# EAGLE design main (EAGLE 9.6.2)
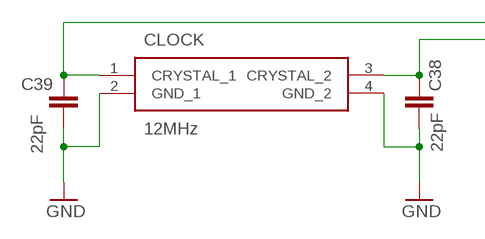
[diagram p0: schematic, sheet 1, part 1 of 3]
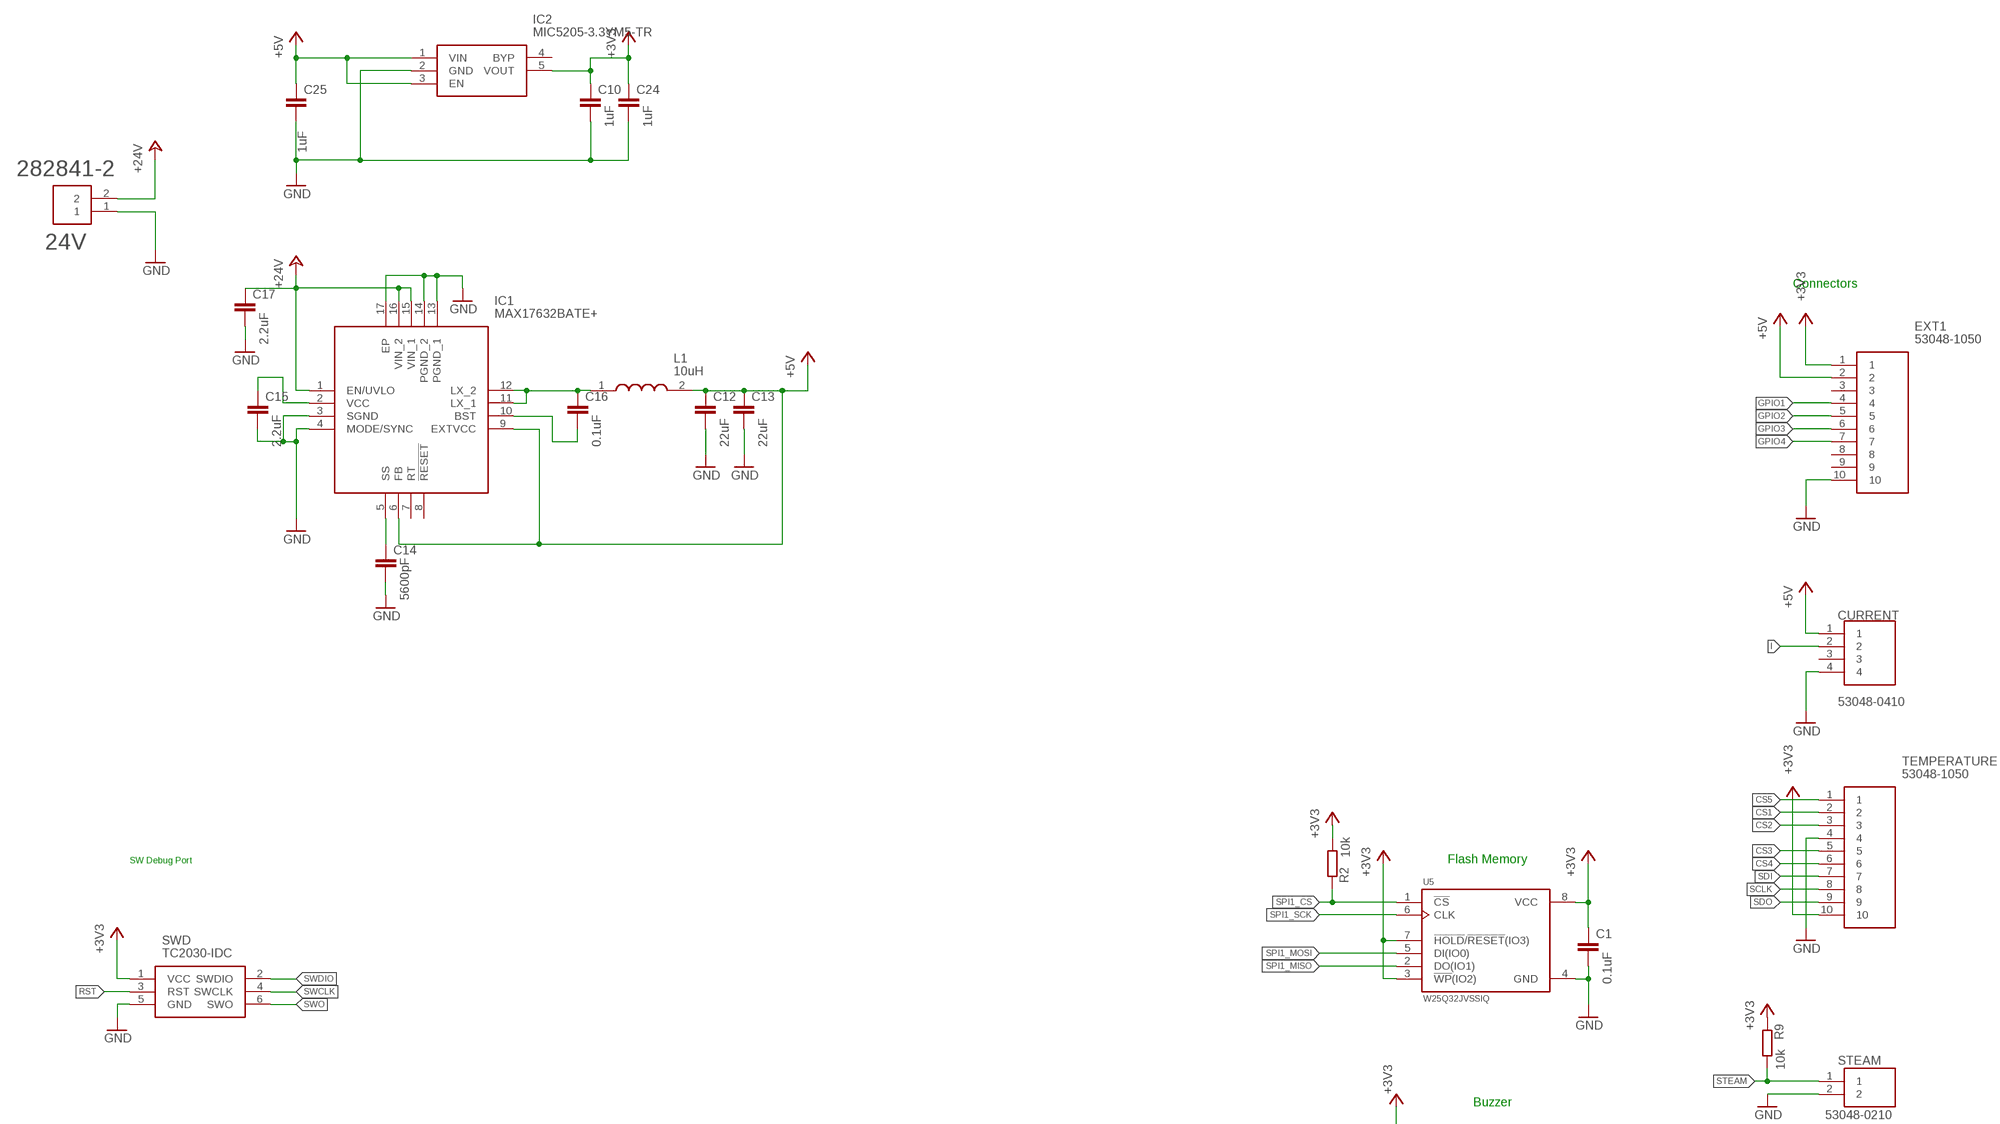
[diagram p1: schematic, sheet 1, part 2 of 3]
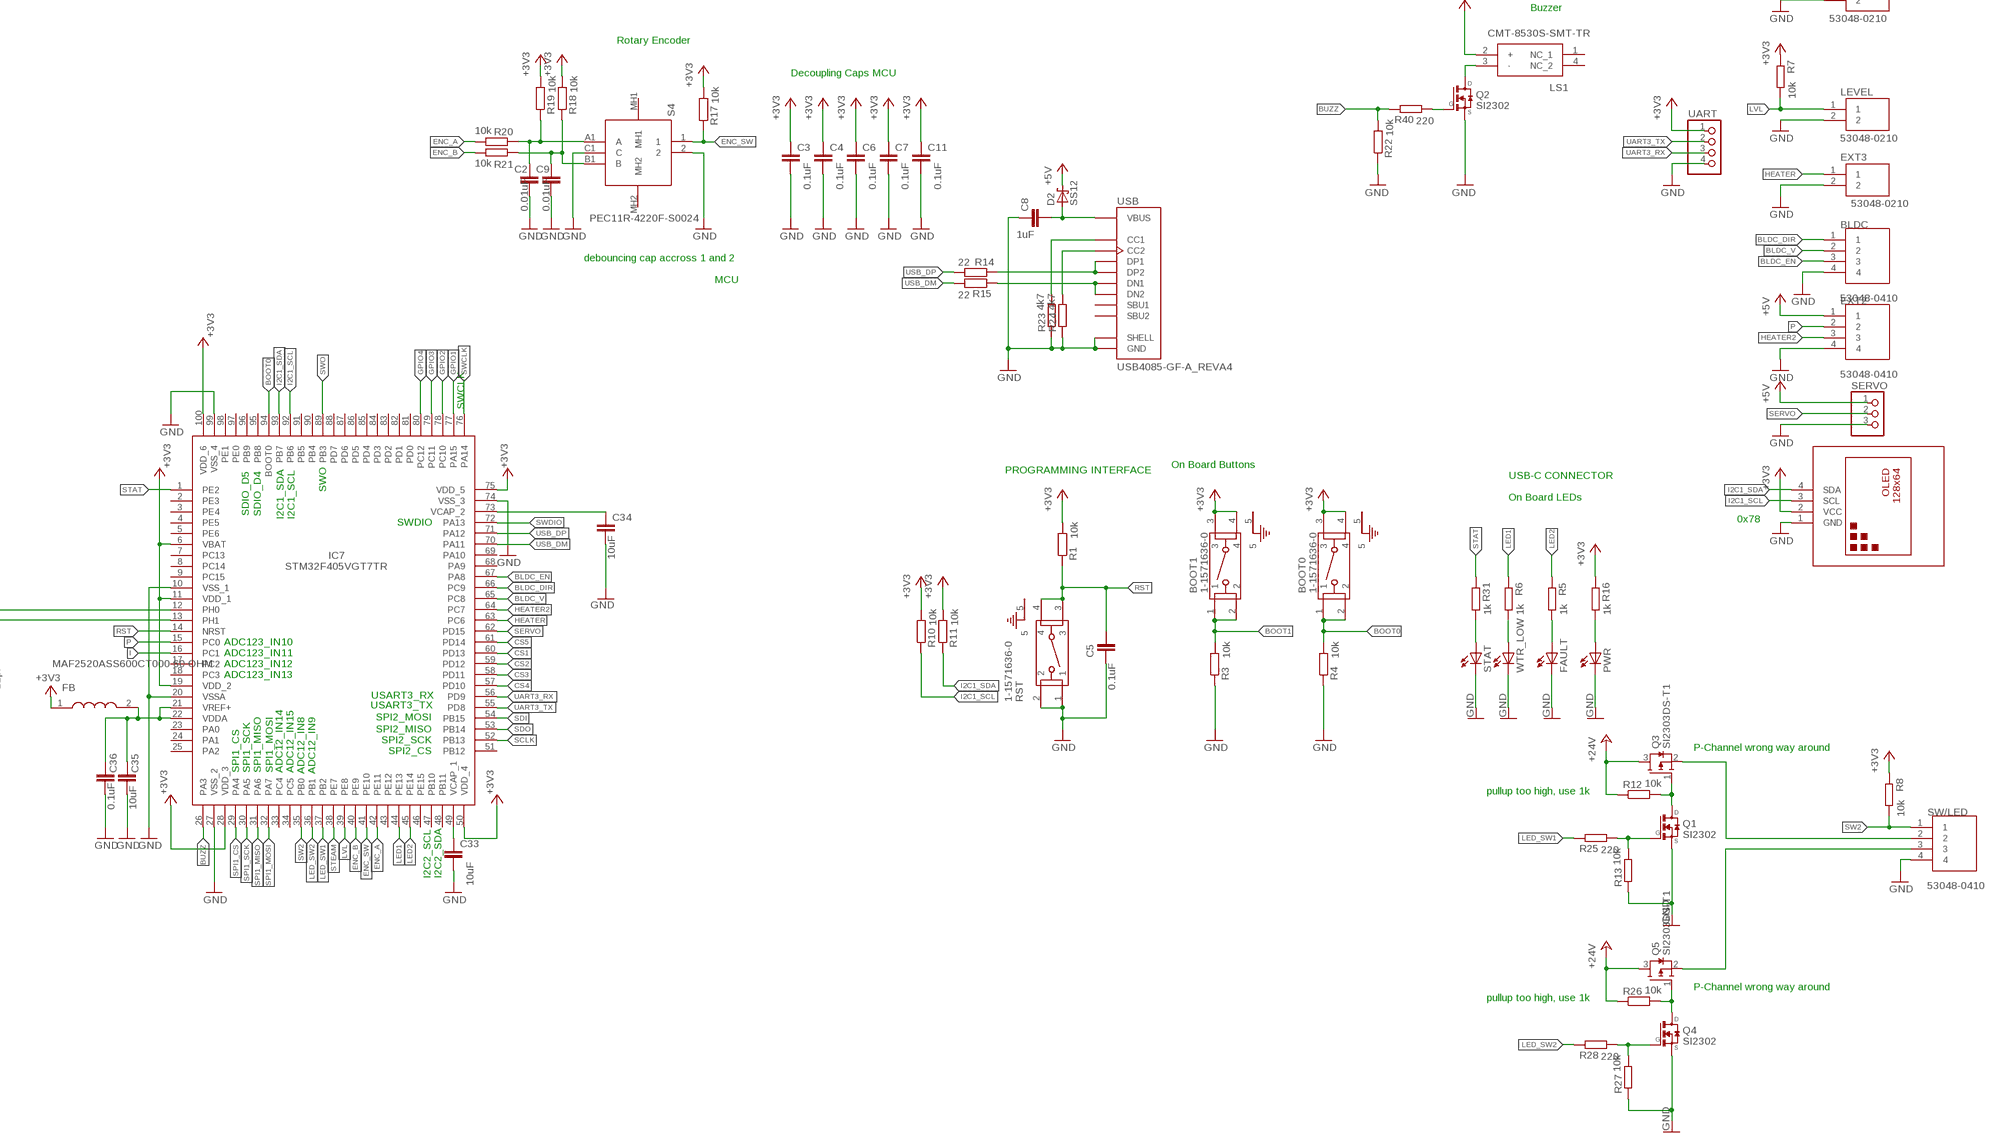
[diagram p2: schematic, sheet 1, part 3 of 3]

## Parts
24V  282841-2  [TE_282841-2]
BLDC  53048-0410  [530480410]
BOOT0  1-1571636-0  [SW5_1571636]
BOOT1  1-1571636-0  [SW5_1571636]
C1  0.1uF  C-EUC0603K  [C0603K]
C2  0.01uF  C-EUC0603K  [C0603K]
C3  0.1uF  C-EUC0603K  [C0603K]
C4  0.1uF  C-EUC0603K  [C0603K]
C5  0.1uF  C-EUC0603K  [C0603K]
C6  0.1uF  C-EUC0603K  [C0603K]
C7  0.1uF  C-EUC0603K  [C0603K]
C8  1uF  C-EUC0603K  [C0603K]
C9  0.01uF  C-EUC0603K  [C0603K]
C10  1uF  C-EUC0603K  [C0603K]
C11  0.1uF  C-EUC0603K  [C0603K]
C12  22uF  C-EUC0603K  [C0603K]
C13  22uF  C-EUC0603K  [C0603K]
C14  5600pF  C-EUC0603K  [C0603K]
C15  2.2uF  C-EUC0603K  [C0603K]
C16  0.1uF  C-EUC0603K  [C0603K]
C17  2.2uF  C-EUC0603K  [C0603K]
C24  1uF  C-EUC0603K  [C0603K]
C25  1uF  C-EUC0603K  [C0603K]
C33  10uF  C-EUC0603K  [C0603K]
C34  10uF  C-EUC0603K  [C0603K]
C35  10uF  C-EUC0603K  [C0603K]
C36  0.1uF  C-EUC0603K  [C0603K]
C38  22pF  C-EUC0603K  [C0603K]
C39  22pF  C-EUC0603K  [C0603K]
CLOCK  12MHz  ABM8AIG-8.000MHZ-1Z-T  [ABM8AIG8000MHZ1ZT]
CURRENT  53048-0410  [530480410]
D2  SS12  [DO214AC]
DISPLAY  DISPLAY-OLED-128X64-I2C  [DISPLAY-OLED-128X64-I2C]
EXT1  53048-1050  [SHDRRA10W25P0X125_1X10_1425X55]
EXT2  53048-0410  [530480410]
EXT3  53048-0210  [SHDRRA2W35P0X125_1X2_425X550X3]
FAULT  LEDCHIPLED_0805  [CHIPLED_0805]
FB  MAF2520ASS600CT000 60 OHM  DFE252012P-1R0M=P2  [INDC2520X120N]
IC1  MAX17632BATE+  [QFN50P300X300X80-17N]
IC2  MIC5205-3.3YM5-TR  [SOT95P280X145-5N]
IC7  STM32F405VGT7TR  [QFP50P1600X1600X160-100N]
L1  10uH  CBC3225T100KR  [INDC3225X270N]
LEVEL  53048-0210  [SHDRRA2W35P0X125_1X2_425X550X3]
LS1  CMT-8530S-SMT-TR  [CMT8530SSMTTR]
PWR  LEDCHIPLED_0805  [CHIPLED_0805]
Q1  SI2302  [SOT23]
Q2  SI2302  [SOT23]
Q3  SI2303DS-T1  [SOT90P248X115-3N]
Q4  SI2302  [SOT23]
Q5  SI2303DS-T1  [SOT90P248X115-3N]
R1  10k  R-EU_R0603  [R0603]
R2  10k  R-EU_R0603  [R0603]
R3  10k  R-EU_R0603  [R0603]
R4  10k  R-EU_R0603  [R0603]
R5  1k  R-EU_R0603  [R0603]
R6  1k  R-EU_R0603  [R0603]
R7  10k  R-EU_R0603  [R0603]
R8  10k  R-EU_R0603  [R0603]
R9  10k  R-EU_R0603  [R0603]
R10  10k  R-EU_R0603  [R0603]
R11  10k  R-EU_R0603  [R0603]
R12  10k  R-EU_R0603  [R0603]
R13  10k  R-EU_R0603  [R0603]
R14  22  R-EU_R0603  [R0603]
R15  22  R-EU_R0603  [R0603]
R16  1k  R-EU_R0603  [R0603]
R17  10k  R-EU_R0603  [R0603]
R18  10k  R-EU_R0603  [R0603]
R19  10k  R-EU_R0603  [R0603]
R20  10k  R-EU_R0603  [R0603]
R21  10k  R-EU_R0603  [R0603]
R22  10k  R-EU_R0603  [R0603]
R23  4k7  R-EU_R0603  [R0603]
R24  4k7  R-EU_R0603  [R0603]
R25  220  R-EU_R0603  [R0603]
R26  10k  R-EU_R0603  [R0603]
R27  10k  R-EU_R0603  [R0603]
R28  220  R-EU_R0603  [R0603]
R31  1k  R-EU_R0603  [R0603]
R40  220  R-EU_R0603  [R0603]
RST  1-1571636-0  [SW5_1571636]
S4  PEC11R-4220F-S0024  [PEC11R4220FS0024]
SERVO  PINHD-1X3/90  [1X03/90]
STAT  LEDCHIPLED_0805  [CHIPLED_0805]
STEAM  53048-0210  [SHDRRA2W35P0X125_1X2_425X550X3]
SW/LED  53048-0410  [530480410]
SWD  TC2030-IDC  [TC2030IDC]
TEMPERATURE  53048-1050  [SHDRRA10W25P0X125_1X10_1425X55]
U5  W25Q32JVSSIQ  [SOIC127P790X216-8N]
UART  PINHD-1X4  [1X04]
USB  USB4085-GF-A_REVA4  [GCT_USB4085-GF-A_REVA4]
WTR_LOW  LEDCHIPLED_0805  [CHIPLED_0805]

## Nets
+3V3: BOOT0.3 BOOT0.4 BOOT1.3 BOOT1.4 C1.1 C3.1 C4.1 C6.1 C7.1 C10.1 C11.1 C24.1 DISPLAY.2(VCC) EXT1.1 FB.1 IC2.5(VOUT) IC7.6(VBAT) IC7.11(VDD_1) IC7.19(VDD_2) IC7.28(VDD_3) IC7.50(VDD_4) IC7.75(VDD_5) IC7.100(VDD_6) LS1.2(+) R1.2 R2.2 R7.1 R8.1 R9.1 R10.2 R11.2 R16.1 R17.2 R18.2 R19.2 SWD.1(VCC) TEMPERATURE.10 U5.3(!WP!(IO2)) U5.7(!HOLD!/!RESET!(IO3)) U5.8(VCC) UART.1
+5V: C12.1 C13.1 C25.1 CURRENT.1 D2.C EXT1.2 EXT2.1 IC1.6(FB) IC1.9(EXTVCC) IC2.1(VIN) IC2.3(EN) L1.2 SERVO.1
+24V: 24V.2 C17.1 IC1.1(EN/UVLO) IC1.15(VIN_1) IC1.16(VIN_2) Q3.3(D) Q5.3(D) R12.1 R26.1
BLDC_DIR: BLDC.1 IC7.66(PC9)
BLDC_EN: BLDC.3 IC7.67(PA8)
BLDC_V: BLDC.2 IC7.65(PC8)
BOOT0: BOOT0.1 BOOT0.2 IC7.94(BOOT0) R4.2
BOOT1: BOOT1.1 BOOT1.2 R3.2
BUZZ: IC7.26(PA3) R22.2 R40.1
CS1: IC7.60(PD13) TEMPERATURE.2
CS2: IC7.59(PD12) TEMPERATURE.3
CS3: IC7.58(PD11) TEMPERATURE.5
CS4: IC7.57(PD10) TEMPERATURE.6
CS5: IC7.61(PD14) TEMPERATURE.1
ENC_A: IC7.42(PE11) R20.2
ENC_B: IC7.40(PE9) R21.2
ENC_SW: IC7.41(PE10) R17.1 S4.1
GND: 24V.1 BLDC.4 C1.2 C2.2 C3.2 C4.2 C5.2 C6.2 C7.2 C8.1 C9.2 C10.2 C11.2 C12.2 C13.2 C14.2 C15.2 C17.2 C24.2 C25.2 C33.2 C34.2 C35.2 C36.2 C38.2 C39.2 CLOCK.2(GND_1) CLOCK.4(GND_2) CURRENT.4 DISPLAY.1(GND) EXT1.10 EXT2.4 EXT3.2 FAULT.C IC1.3(SGND) IC1.4(MODE/SYNC) IC1.13(PGND_1) IC1.14(PGND_2) IC1.17(EP) IC2.2(GND) IC7.10(VSS_1) IC7.20(VSSA) IC7.27(VSS_2) IC7.74(VSS_3) IC7.99(VSS_4) LEVEL.2 PWR.C Q1.2(S) Q2.2(S) Q4.2(S) R3.1 R4.1 R13.1 R22.1 R23.1 R24.1 R27.1 RST.1 RST.2 S4.2 S4.C1(C) SERVO.3 STAT.C STEAM.2 SW/LED.4 SWD.5(GND) TEMPERATURE.4 U5.4(GND) UART.4 USB.A1(GND) USB.A12(GND) USB.B1(GND) USB.B12(GND) USB.P1(SHELL) USB.P2(SHELL) USB.P3(SHELL) USB.P4(SHELL) WTR_LOW.C
GPIO1: EXT1.4 IC7.77(PA15)
GPIO2: EXT1.5 IC7.78(PC10)
GPIO3: EXT1.6 IC7.79(PC11)
GPIO4: EXT1.7 IC7.80(PC12)
HEATER: EXT3.1 IC7.63(PC6)
HEATER2: EXT2.3 IC7.64(PC7)
I: CURRENT.2 IC7.16(PC1)
I2C1_SCL: DISPLAY.3(SCL) IC7.92(PB6) R10.1
I2C1_SDA: DISPLAY.4(SDA) IC7.93(PB7) R11.1
LED1: IC7.44(PE13) R6.1
LED2: IC7.45(PE14) R5.1
LED_SW1: IC7.37(PB2) R25.1
LED_SW2: IC7.36(PB1) R28.1
LVL: IC7.39(PE8) LEVEL.1 R7.2
N$1: R14.1 USB.A6(DP1) USB.B6(DP2)
N$2: R15.1 USB.A7(DN1) USB.B7(DN2)
N$3: R24.2 USB.B5(CC2)
N$4: R23.2 USB.A5(CC1)
N$5: LS1.3(-) Q2.3(D)
N$6: R6.2 WTR_LOW.A
N$7: PWR.A R16.2
N$9: FAULT.A R5.2
N$10: R31.2 STAT.A
N$12: C9.1 R18.1 R21.1 S4.B1(B)
N$13: C14.1 IC1.5(SS)
N$14: C2.1 R19.1 R20.1 S4.A1(A)
N$15: C16.2 IC1.10(BST)
N$16: C8.2 D2.A USB.A4(VBUS) USB.A9(VBUS) USB.B4(VBUS) USB.B9(VBUS)
N$17: Q1.3(D) Q3.1(G) R12.2
N$19: C15.1 IC1.2(VCC)
N$21: C16.1 IC1.11(LX_1) IC1.12(LX_2) L1.1
N$22: Q1.1(G) R13.2 R25.2
N$23: C34.1 IC7.73(VCAP_2)
N$24: Q4.3(D) Q5.1(G) R26.2
N$26: Q4.1(G) R27.2 R28.2
N$27: C35.1 C36.1 FB.2 IC7.21(VREF+) IC7.22(VDDA)
N$28: Q3.2(S) SW/LED.2
N$29: Q5.2(S) SW/LED.3
N$35: Q2.1(G) R40.2
N$38: C33.1 IC7.49(VCAP_1)
N$47: C38.1 CLOCK.3(CRYSTAL_2) IC7.13(PH1)
N$52: C39.1 CLOCK.1(CRYSTAL_1) IC7.12(PH0)
P: EXT2.2 IC7.15(PC0)
RST: C5.1 IC7.14(NRST) R1.1 RST.3 RST.4 SWD.3(RST)
SCLK: IC7.52(PB13) TEMPERATURE.8
SDI: IC7.54(PB15) TEMPERATURE.7
SDO: IC7.53(PB14) TEMPERATURE.9
SERVO: IC7.62(PD15) SERVO.2
SPI1_CS: IC7.29(PA4) R2.1 U5.1(!CS)
SPI1_MISO: IC7.31(PA6) U5.2(DO(IO1))
SPI1_MOSI: IC7.32(PA7) U5.5(DI(IO0))
SPI1_SCK: IC7.30(PA5) U5.6(CLK)
STAT: IC7.1(PE2) R31.1
STEAM: IC7.38(PE7) R9.2 STEAM.1
SW2: IC7.35(PB0) R8.2 SW/LED.1
SWCLK: IC7.76(PA14) SWD.4(SWCLK)
SWDIO: IC7.72(PA13) SWD.2(SWDIO)
SWO: IC7.89(PB3) SWD.6(SWO)
UART3_RX: IC7.56(PD9) UART.3
UART3_TX: IC7.55(PD8) UART.2
USB_DM: IC7.70(PA11) R15.2
USB_DP: IC7.71(PA12) R14.2
Unconnected: BOOT0.5 BOOT1.5 CURRENT.3 EXT1.3 EXT1.8 EXT1.9 IC1.7(RT) IC1.8(!RESET) IC2.4(BYP) IC7.2(PE3) IC7.3(PE4) IC7.4(PE5) IC7.5(PE6) IC7.7(PC13) IC7.8(PC14) IC7.9(PC15) IC7.17(PC2) IC7.18(PC3) IC7.23(PA0) IC7.24(PA1) IC7.25(PA2) IC7.33(PC4) IC7.34(PC5) IC7.43(PE12) IC7.46(PE15) IC7.47(PB10) IC7.48(PB11) IC7.51(PB12) IC7.68(PA9) IC7.69(PA10) IC7.81(PD0) IC7.82(PD1) IC7.83(PD2) IC7.84(PD3) IC7.85(PD4) IC7.86(PD5) IC7.87(PD6) IC7.88(PD7) IC7.90(PB4) IC7.91(PB5) IC7.95(PB8) IC7.96(PB9) IC7.97(PE0) IC7.98(PE1) LS1.1(NC_1) LS1.4(NC_2) RST.5 S4.MH1 S4.MH2 USB.A8(SBU1) USB.B8(SBU2)

## Notes on the sheet
- Connectors
- SW Debug Port | Flash Memory
- Buzzer
- Rotary Encoder
- Decoupling Caps MCU
- debouncing cap accross 1 and 2
- MCU
- SWCLK
- On Board Buttons
- SDIO_D4 | PROGRAMMING INTERFACE
- USB-C CONNECTOR
- SWO
- On Board LEDs
- SDIO_D5
- I2C1_SDA | I2C1_SCL
- 0x78
- SWDIO
- ADC123_IN10
- ADC123_IN11
- ADC123_IN12
- ADC123_IN13
- USART3_RX
- USART3_TX
- SPI2_MOSI
- SPI2_MISO
- SPI2_SCK
- SPI2_CS
- P-Channel wrong way around
- SPI1_CS | SPI1_SCK | SPI1_MISO | SPI1_MOSI | ADC12_IN14 | ADC12_IN15 | ADC12_IN8 | ADC12_IN9
- pullup too high, use 1k
- I2C2_SCL | I2C2_SDA
- P-Channel wrong way around
- pullup too high, use 1k

## Library data of the parts
24V = 282841-2:282841-2: TERM BLOCK 2POS SIDE ENT 5.08MM; COMMENT: 282841-2; DESCRIPTION: Conn Terminal Block 2 POS 5.08mm Solder ST Thru-Hole 17.5A/Contact; DIGI-KEY_PART_NUMBER: A98342-ND; DIGI-KEY_PURCHASE_URL: https://www.digikey.com/product-detail/en/te-connectivity-amp-connectors/282841-2/A98342-ND/1136740?utm_source=snapeda&utm_medium=aggregator&utm_campaign=symbol; EU_ROHS_COMPLIANCE: Compliant with Exemptions; MF: TE Connectivity; MP: 282841-2; PACKAGE: None; TE_PURCHASE_URL: https://www.te.com/usa-en/product-282841-2.html?te_bu=Cor&te_type=disp&te_campaign=seda_glo_cor-seda-global-disp-prtnr-fy19-seda-model-bom-cta_sma-317_1&elqCampaignId=32493
BLDC CURRENT EXT2 SW/LED = 53048-0410:53048-0410: Headers & Wire Housings RIGHT ANGLE HDR 4P Source: Datasheet <https://www.molex.com/pdm_docs/sd/530480410_sd.pdf>; DESCRIPTION: Headers & Wire Housings RIGHT ANGLE HDR 4P; HEIGHT: 3.7mm; MANUFACTURER_NAME: Molex; MANUFACTURER_PART_NUMBER: 53048-0410; MOUSER_PART_NUMBER: 538-53048-0410; MOUSER_PRICE-STOCK: https://www.mouser.co.uk/ProductDetail/Molex/53048-0410?qs=359VwiUTsp2msj5Tobchuw%3D%3D
BOOT0 BOOT1 RST = TACTILE:1-1571636-0; BUILT_BY: EMA_UL_Team; CONFIGURATION__POLE-THROW_: Single Pole - Single Throw; COPYRIGHT: Copyright (C) 2016 Accelerated Designs. All rights reserved; DESCRIPTION: TACT,SMT,GULL WING,260GF,T&R; MANUFACTURER_PART_NUMBER: 1-1571636-0; MAX_SWITCHING_CURRENT: -; MAX_SWITCHING_VOLTAGE_AC_: -; PRODUCT_TYPE: Switch; SWITCH_TYPE: Tactile Switches; TE_PART_NUMBER: 1-1571636-0; VENDOR: TE Connectivity
C1-C17 C24 C25 C33-C36 C38 C39 = rcl:C-EU: CAPACITOR, European symbol; SPICEPREFIX: C
CLOCK = ABM8AIG-8.000MHZ-1Z-T:ABM8AIG-8.000MHZ-1Z-T: Crystals 18pF 8MHz 10ppm AEC-Q200 -40C +125C Source: Datasheet <https://abracon.com/AIGcrystals/ABM8AIG.pdf>; DESCRIPTION: Crystals 18pF 8MHz 10ppm AEC-Q200 -40C +125C; HEIGHT: 0.8mm; MANUFACTURER_NAME: ABRACON; MANUFACTURER_PART_NUMBER: ABM8AIG-8.000MHZ-1Z-T; MOUSER_PART_NUMBER: 815-M8AIG-8-1ZT; MOUSER_PRICE-STOCK: https://www.mouser.com/Search/Refine.aspx?Keyword=815-M8AIG-8-1ZT
D2 = SS12:SS12: http://octopart.com/ss12-tp-mcc-9293796; AVAILABILITY: Unavailable; DESCRIPTION: SS12 Series 500 mV 1 A 20 V Max Reverse Voltage Schottky Rectifier - DO-214AC; MF: Klein Tools,; MP: SS12; PACKAGE: DO-214AC-214 ON Semiconductor; PRICE: None
DISPLAY = diy-modules:DISPLAY-OLED-128X64-I2C: 128x64 Dot Matrix OLED Module based on SSD1306 chip Variant with I2C interface More details available here: http://www.instructables.com/id/Monochrome-096-i2c-OLED-display-with-arduino-SSD13/ SSD1306 datasheet: https://cdn-shop.adafruit.com/datasheets/SSD1306.pdf Click here to find device on ebay.com <http://www.ebay.com/sch/oled+display+128x64+iic> Note: There are two variants: I2C and SPI. Search for the proper version.
EXT1 TEMPERATURE = 53048-1050:53048-1050: 1.25mm Pitch, PicoBlade PCB Header, Single Row, Right-Angle, Through Hole, Gold (Au) Plating, Friction Lock, 4 Circuits, Tape and Reel, 2.30mm PC Tail Length Source: Datasheet <https://www.mouser.com/datasheet/2/276/0530481050_PCB_HEADERS-1532231.pdf>; DESCRIPTION: 1.25mm Pitch, PicoBlade PCB Header, Single Row, Right-Angle, Through Hole, Gold (Au) Plating, Friction Lock, 4 Circuits, Tape and Reel, 2.30mm PC Tail Length; HEIGHT: 3.5mm; MANUFACTURER_NAME: Molex; MANUFACTURER_PART_NUMBER: 53048-1050; MOUSER_PART_NUMBER: 538-53048-1050; MOUSER_PRICE-STOCK: https://www.mouser.co.uk/ProductDetail/Molex/53048-1050?qs=0lSvoLzn4L%252B50FRVV9pEsg%3D%3D
EXT3 LEVEL STEAM = 53048-0210:53048-0210: 2 way through board PCB 90deg header Molex PICOBLADE Series, Series Number 53048, 1.25mm Pitch 2 Way 1 Row Right Angle PCB Header, Solder Termination, 1A Source: Datasheet <https://www.molex.com/pdm_docs/sd/530481010_sd.pdf>; DESCRIPTION: 2 way through board PCB 90deg header Molex PICOBLADE Series, Series Number 53048, 1.25mm Pitch 2 Way 1 Row Right Angle PCB Header, Solder Termination, 1A; HEIGHT: 3.5mm; MANUFACTURER_NAME: Molex; MANUFACTURER_PART_NUMBER: 53048-0210; MOUSER_PART_NUMBER: 538-53048-0210; MOUSER_PRICE-STOCK: https://www.mouser.co.uk/ProductDetail/Molex/53048-0210?qs=o4r9IV%252BgZWMoVY43HmKPkg%3D%3D
FAULT PWR STAT WTR_LOW = led:LED: LED OSRAM: - CHIPLED LG R971, LG N971, LY N971, LG Q971, LY Q971, LO R971, LY R971 LH N974, LH R974 LS Q976, LO Q976, LY Q976 LO Q996 - Hyper CHIPLED LW Q18S LB Q993, LB Q99A, LB R99A - SideLED LS A670, LO A670, LY A670, LG A670, LP A670 LB A673, LV A673, LT A673, LW A673 LH A674 LY A675 LS A676, LA A676, LO A676, LY A676, LW A676 LS A679, LY A679, LG A679 - Hyper Micro SIDELED® LS Y876, LA Y876, LO Y876, LY Y876 LT Y87S - SmartLED LW L88C, LW L88S LB L89C, LB L89S, LG L890 LS L89K, LO L89K, LY L89K LS L896, LA L896, LO L896, LY L896 - TOPLED LS T670, LO T670, LY T670, LG T670, LP T670 LSG T670, LSP T670, LSY T670, LOP T670, LYG T670 LG T671, LOG T671, LSG T671 LB T673, LV T673, LT T673, LW T673 LH T674 LS T676, LA T676, LO T676, LY T676, LB T676, LH T676, LSB T676, LW T676 LB T67C, LV T67C, LT T67C, LS T67K, LO T67K, LY T67K, LW E67C LS E67B, LA E67B, LO E67B, LY E67B, LB E67C, LV E67C, LT E67C LW T67C LS T679, LY T679, LG T679 LS T770, LO T770, LY T770, LG T770, LP T770 LB T773, LV T773, LT T773, LW T773 LH T774 LS E675, LA E675, LY E675, LS T675 LS T776, LA T776, LO T776, LY T776, LB T776 LHGB T686 LT T68C, LB T68C - Hyper Mini TOPLED® LB M676 - Mini TOPLED Santana® LG M470 LS M47K, LO M47K, LY M47K Source: http://www.osram.convergy.de LUXEON: - LUMILED® LXK2-PW12-R00, LXK2-PW12-S00, LXK2-PW14-U00, LXK2-PW14-V00 LXK2-PM12-R00, LXK2-PM12-S00, LXK2-PM14-U00 LXK2-PE12-Q00, LXK2-PE12-R00, LXK2-PE12-S00, LXK2-PE14-T00, LXK2-PE14-U00 LXK2-PB12-K00, LXK2-PB12-L00, LXK2-PB12-M00, LXK2-PB14-N00, LXK2-PB14-P00, LXK2-PB14-Q00 LXK2-PR12-L00, LXK2-PR12-M00, LXK2-PR14-Q00, LXK2-PR14-R00 LXK2-PD12-Q00, LXK2-PD12-R00, LXK2-PD12-S00 LXK2-PH12-R00, LXK2-PH12-S00 LXK2-PL12-P00, LXK2-PL12-Q00, LXK2-PL12-R00 Source: www.luxeon.com KINGBRIGHT: KA-3528ASYC Source: www.kingbright.com
FB = DFE252012P-1R0M=P2:DFE252012P-1R0M=P2: Toko DFE252012P Series Shielded Wire-wound SMD Inductor with a Powered Iron Core, 1 uH Wire-Wound 4.8A Idc Source: Datasheet <https://psearch.en.murata.com/inductor/product/DFE252012P-1R0M#.html>; DESCRIPTION: Toko DFE252012P Series Shielded Wire-wound SMD Inductor with a Powered Iron Core, 1 uH Wire-Wound 4.8A Idc; HEIGHT: 1.2mm; MANUFACTURER_NAME: Murata Electronics; MANUFACTURER_PART_NUMBER: DFE252012P-1R0M=P2; MOUSER_PART_NUMBER: 81-DFE252012P-1R0MP2; MOUSER_PRICE-STOCK: https://www.mouser.com/Search/Refine.aspx?Keyword=81-DFE252012P-1R0MP2; RS_PART_NUMBER: 1058572P; RS_PRICE-STOCK: http://uk.rs-online.com/web/p/products/1058572P
IC1 = MAX17632BATE+:MAX17632BATE+: Switching Voltage Regulators 36V 2A DC-DC Converter Source: Datasheet <https://datasheets.maximintegrated.com/en/ds/MAX17632.pdf>; DESCRIPTION: Switching Voltage Regulators 36V 2A DC-DC Converter; HEIGHT: 0.8mm; MANUFACTURER_NAME: Maxim Integrated; MANUFACTURER_PART_NUMBER: MAX17632BATE+; MOUSER_PART_NUMBER: 700-MAX17632BATE+; MOUSER_PRICE-STOCK: https://www.mouser.co.uk/ProductDetail/Maxim-Integrated/MAX17632BATE%2b?qs=rrS6PyfT74eYgQOfvlc4tA%3D%3D
IC2 = MIC5205-3.3YM5-TR:MIC5205-3.3YM5-TR: 150mA 1% Low Noise LDO MIC5205-3.3YM5 TR Microchip MIC5205-3.3YM5-TR, LDO Voltage Regulator, 150mA, 3.3 V 1%, 2.5 16 Vin, 5-Pin SOT-23 Source: Datasheet <http://ww1.microchip.com/downloads/en/DeviceDoc/20005785A.pdf>; DESCRIPTION: 150mA 1% Low Noise LDO MIC5205-3.3YM5 TR Microchip MIC5205-3.3YM5-TR, LDO Voltage Regulator, 150mA, 3.3 V 1%, 2.5 16 Vin, 5-Pin SOT-23; HEIGHT: 1.45mm; MANUFACTURER_NAME: Microchip; MANUFACTURER_PART_NUMBER: MIC5205-3.3YM5-TR; MOUSER_PART_NUMBER: 998-MIC5205-3.3YM5TR; MOUSER_PRICE-STOCK: https://www.mouser.co.uk/ProductDetail/Microchip-Technology-Micrel/MIC5205-33YM5-TR?qs=U6T8BxXiZAUfeWKvTx3acw%3D%3D
IC7 = STM32F405VGT7TR:STM32F405VGT7TR: STM32F405VGT7TR, 32 bit ARM Cortex M4 MCU 168MHz 1024 kB Flash, 192 kB RAM, 2xUSB CAN I2C 100-Pin LQFP Source: Datasheet <http://www.st.com/web/en/resource/technical/document/datasheet/DM00037051.pdf>; ALLIED_NUMBER: 70391103; ALLIED_PRICE-STOCK: http://www.alliedelec.com/stmicroelectronics-stm32f405vgt7tr/70391103/; DESCRIPTION: STM32F405VGT7TR, 32 bit ARM Cortex M4 MCU 168MHz 1024 kB Flash, 192 kB RAM, 2xUSB CAN I2C 100-Pin LQFP; HEIGHT: 1.6mm; MANUFACTURER_NAME: STMicroelectronics; MANUFACTURER_PART_NUMBER: STM32F405VGT7TR; MOUSER_PART_NUMBER: 511-STM32F405VGT7TR; MOUSER_PRICE-STOCK: https://www.mouser.com/Search/Refine.aspx?Keyword=511-STM32F405VGT7TR; RS_PART_NUMBER: 7926025; RS_PRICE-STOCK: https://uk.rs-online.com/web/p/products/7926025
L1 = CBC3225T100KR:CBC3225T100KR: Fixed Inductors 1210 10uH 172.9mOhms +/-10% 900mA HiCur Source: Datasheet <https://mouser.componentsearchengine.com/Datasheets/1/CBC3225T100KR.pdf>; ARROW_PART_NUMBER: CBC3225T100KR; ARROW_PRICE-STOCK: https://www.arrow.com/en/products/cbc3225t100kr/taiyo-yuden; DESCRIPTION: Fixed Inductors 1210 10uH 172.9mOhms +/-10% 900mA HiCur; HEIGHT: 2.7mm; MANUFACTURER_NAME: TAIYO YUDEN; MANUFACTURER_PART_NUMBER: CBC3225T100KR; MOUSER_PART_NUMBER: 963-CBC3225T100KR; MOUSER_PRICE-STOCK: https://www.mouser.co.uk/ProductDetail/Taiyo-Yuden/CBC3225T100KR?qs=I6KAKw0tg2xBtBHDie3dYA%3D%3D
LS1 = CMT-8530S-SMT-TR:CMT-8530S-SMT-TR: Speakers & Transducers Buzzer 8.5mm sq 2.73kHz 3.6V SMT Source: Datasheet <https://www.cui.com/product/resource/cmt-8530s-smt.pdf>; DESCRIPTION: Speakers & Transducers Buzzer 8.5mm sq 2.73kHz 3.6V SMT; HEIGHT: 3mm; MANUFACTURER_NAME: CUI Devices; MANUFACTURER_PART_NUMBER: CMT-8530S-SMT-TR; MOUSER_PART_NUMBER: 490-CMT-8530S-SMT-TR; MOUSER_PRICE-STOCK: https://www.mouser.co.uk/ProductDetail/CUI-Devices/CMT-8530S-SMT-TR?qs=qCxwlXJ4fnxl6A4lXsnRBQ%3D%3D
Q1 Q2 Q4 = SI2302:SI2302: MOSFET N-Channel 20 V (D-S); AVAILABILITY: Unavailable; DESCRIPTION: MOSFET 20V 3A; MF: Micro Commercial Components _MCC_; MP: SI2302; PACKAGE: TO-236-3 Micro Commercial Components _MCC_; PRICE: None
Q3 Q5 = SI2303DS-T1:SI2303DS-T1: MOSFET 30V 1.7A 1.25W Source: Datasheet <http://www.vishay.com/docs/70770/70770.pdf>; DESCRIPTION: MOSFET 30V 1.7A 1.25W; HEIGHT: 1.15mm; MANUFACTURER_NAME: Vishay; MANUFACTURER_PART_NUMBER: SI2303DS-T1; MOUSER_PART_NUMBER: 781-SI2303DS; MOUSER_PRICE-STOCK: https://www.mouser.com/Search/Refine.aspx?Keyword=781-SI2303DS
R1-R28 R31 R40 = rcl:R-EU_: RESISTOR, European symbol; SPICEPREFIX: R
S4 = PEC11R-4220F-S0024:PEC11R-4220F-S0024: Bourns 24 Pulse Incremental Mechanical Rotary Encoder with a 6 mm Flat Shaft (Not Indexed), Through Hole Source: Datasheet <https://www.bourns.com/docs/Product-Datasheets/PEC11R.pdf>; ARROW_PART_NUMBER: PEC11R-4220F-S0024; ARROW_PRICE-STOCK: https://www.arrow.com/en/products/pec11r-4220f-s0024/bourns; DESCRIPTION: Bourns 24 Pulse Incremental Mechanical Rotary Encoder with a 6 mm Flat Shaft (Not Indexed), Through Hole; HEIGHT: 27.5mm; MANUFACTURER_NAME: Bourns; MANUFACTURER_PART_NUMBER: PEC11R-4220F-S0024; MOUSER_PART_NUMBER: 652-PEC11R-4220F-S24; MOUSER_PRICE-STOCK: https://www.mouser.co.uk/ProductDetail/Bourns/PEC11R-4220F-S0024?qs=Zq5ylnUbLm6NGsQdib%2Ffbw%3D%3D
SERVO = pinhead:PINHD-1X3: PIN HEADER
SWD = TC2030-IDC:TC2030-IDC: CABLE ADAPTER 6 POS Source: Datasheet <http://www.tag-connect.com/Materials/TC2030-IDC.pdf>; DESCRIPTION: CABLE ADAPTER 6 POS; HEIGHT: 19mm; MANUFACTURER_NAME: Tag Connect; MANUFACTURER_PART_NUMBER: TC2030-IDC
U5 = W25Q32JVSSIQ:W25Q32JVSSIQ: NOR Flash Serial-SPI 3V/3.3V 32M-bit 4M x 8 8.5ns 8-Pin SOIC; AVAILABILITY: Unavailable; DESCRIPTION: NOR Flash Serial-SPI 3V 32Mbit 32M x 1bit 8-Pin SOIC; MF: Winbond; MP: W25Q32JVSSIQ; PACKAGE: SOIC-8 Winbond; PRICE: None
UART = pinhead:PINHD-1X4: PIN HEADER
USB = USB4085-GF-A_REVA4:USB4085-GF-A_REVA4: USB 2.0 Type C Receptacle Dip Type, PCB Top Mount Check prices <https://pricing.snapeda.com/parts/USB4085-GF-A/Global%20Connector%20Technology/view-part?ref=eda>; AVAILABILITY: In Stock; DESCRIPTION: USB-C (USB TYPE-C) USB 2.0 Receptacle Connector 24 (16+8 Dummy) Position Through Hole, Right Angle, low cost, 3.46mm profile, 16 pin, horizontal, Top mount; MF: Global Connector Technology; MP: USB4085-GF-A; PACKAGE: None; PRICE: None; PURCHASE-URL: https://pricing.snapeda.com/search/part/USB4085-GF-A/?ref=eda

## Board
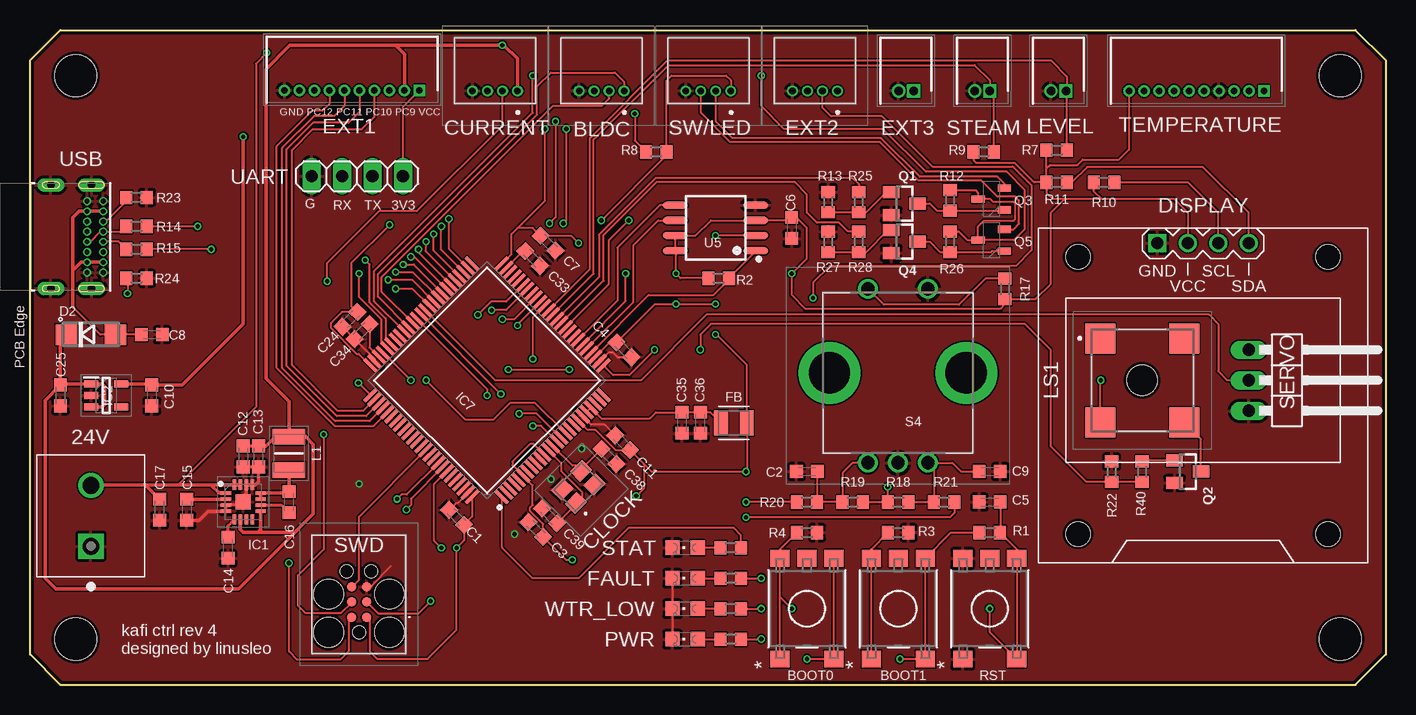
[diagram p3: board, top side]
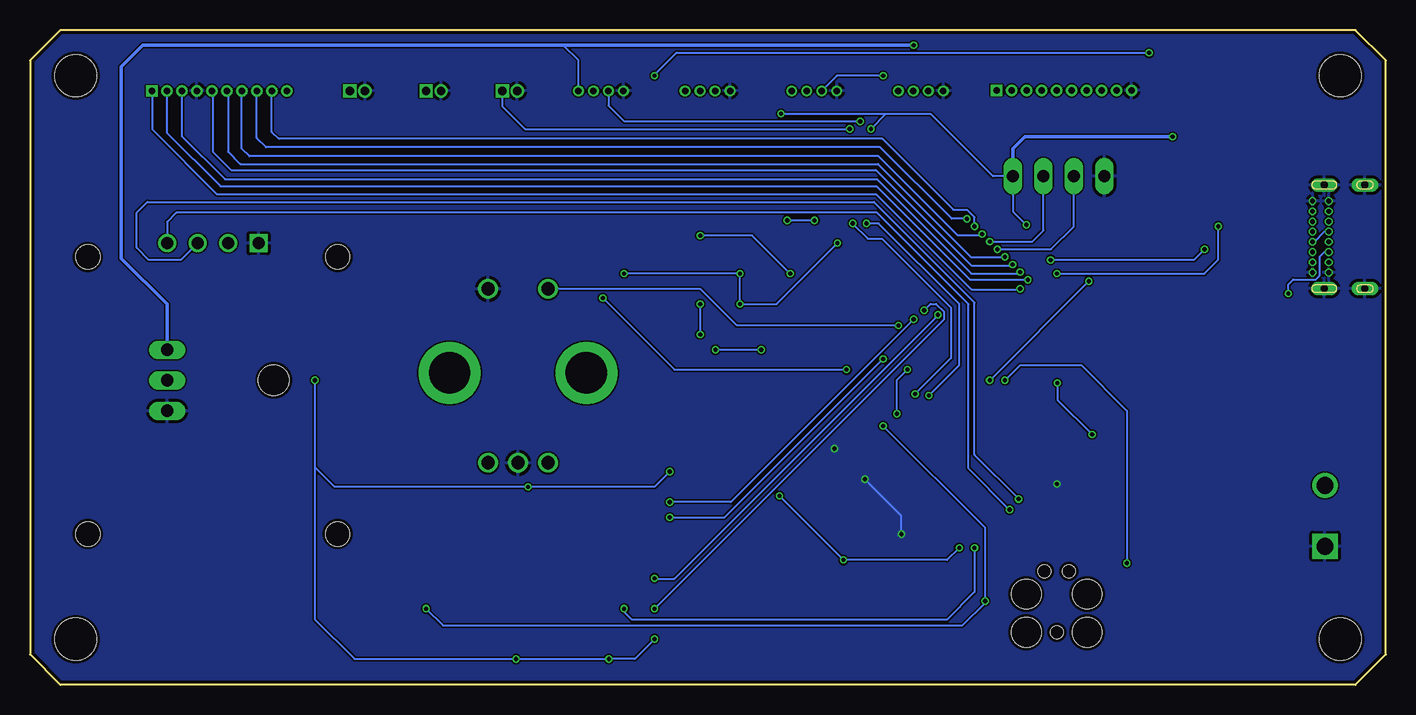
[diagram p4: board, bottom side, seen from below]

Size 113.03 x 54.61 mm. Coordinates in mm from the lower left corner, seen from the top.
Outline: 2.54,54.61 110.49,54.61 113.03,52.07 113.03,2.54 110.49,0 2.54,0 0,2.54 0,52.07 2.54,54.61
Copper layers (1*16): Top 0.035mm / dielectric 1.5mm / Bottom 0.035mm
Design rules "default *": minimum track width 6mil, minimum drill 0.35mm, track to track 5mil, track to pad 5mil, pad to pad 5mil, via to via 5mil, smd to smd 5mil, copper to edge 10mil, drill to drill 6mil, minimum pad ring 5mil, minimum via ring 5mil, stop-mask expansion 4mil, vias tented up to drill 0mil, thermal gap 10mil
Holes 3.5 mm at 109.22,50.8 109.22,3.81 3.81,3.81 3.81,50.8

### Footprints (pad centres in the part's own frame; a part is rotated, then mirrored left to right if it is on the bottom)
TE_282841-2 = drill 1.4 square: 1 -2.54,0 | drill 1.4: 2 2.54,0
530480410 = drill 0.55 pad 0.9: 1 0,0; 2 -1.25,0; 3 -2.5,0; 4 -3.75,0
SW5_1571636 = smd 1.397 x 1.6: 1 -4.204,2.248; 2 4.204,2.248; 3 -4.204,-2.248; 4 4.204,-2.248; 5 4.204,0
C0603K = smd 1.05 x 1.08: 1 -0.875,0; 2 0.875,0
ABM8AIG8000MHZ1ZT = smd 1.4 x 1.2: 1 -1.1,-0.8; 2 1.1,-0.8; 3 1.1,0.8; 4 -1.1,0.8
DO214AC = smd 1.8 x 1.7: A 2.05,0; C -2.05,0
DISPLAY-OLED-128X64-I2C = drill 1 square: 1 -3.81,12.7 | drill 1: 2 -1.27,12.7; 3 1.27,12.7; 4 3.81,12.7 | hole 2: -10.414,11.557; 10.414,11.557; 10.414,-11.557; -10.414,-11.557
SHDRRA10W25P0X125_1X10_1425X55 = drill 0.55 pad 0.95 square: 1 0,0 | drill 0.55 pad 0.95: 2 -1.25,0; 3 -2.5,0; 4 -3.75,0; 5 -5,0; 6 -6.25,0; 7 -7.5,0; 8 -8.75,0; 9 -10,0; 10 -11.25,0
SHDRRA2W35P0X125_1X2_425X550X3 = drill 0.7 pad 1.1 square: 1 0,0 | drill 0.7 pad 1.1: 2 -1.25,0
CHIPLED_0805 = smd 1.2 x 1.2: A 0,-1.05; C 0,1.05
INDC2520X120N = smd 1.147 x 2.112: 1 -1.076,0; 2 1.076,0
QFN50P300X300X80-17N = smd 0.85 x 0.3: 1 -1.45,0.75; 2 -1.45,0.25; 3 -1.45,-0.25; 4 -1.45,-0.75; 9 1.45,-0.75; 10 1.45,-0.25; 11 1.45,0.25; 12 1.45,0.75 | smd 0.3 x 0.85: 5 -0.75,-1.45; 6 -0.25,-1.45; 7 0.25,-1.45; 8 0.75,-1.45; 13 0.75,1.45; 14 0.25,1.45; 15 -0.25,1.45; 16 -0.75,1.45 | smd 1.25 x 1.25: 17 0,0
SOT95P280X145-5N = smd 1.2 x 0.6: 1 -1.25,0.95; 2 -1.25,0; 3 -1.25,-0.95; 4 1.25,-0.95; 5 1.25,0.95
QFP50P1600X1600X160-100N = smd 1.475 x 0.3: 1 -7.738,6; 2 -7.738,5.5; 3 -7.738,5; 4 -7.738,4.5; 5 -7.738,4; 6 -7.738,3.5; 7 -7.738,3; 8 -7.738,2.5; 9 -7.738,2; 10 -7.738,1.5; 11 -7.738,1; 12 -7.738,0.5; 13 -7.738,0; 14 -7.738,-0.5; 15 -7.738,-1; 16 -7.738,-1.5; 17 -7.738,-2; 18 -7.738,-2.5; 19 -7.738,-3; 20 -7.738,-3.5; 21 -7.738,-4; 22 -7.738,-4.5; 23 -7.738,-5; 24 -7.738,-5.5; 25 -7.738,-6; 51 7.738,-6; 52 7.738,-5.5; 53 7.738,-5; 54 7.738,-4.5; 55 7.738,-4; 56 7.738,-3.5; 57 7.738,-3; 58 7.738,-2.5; 59 7.738,-2; 60 7.738,-1.5; 61 7.738,-1; 62 7.738,-0.5; 63 7.738,0; 64 7.738,0.5; 65 7.738,1; 66 7.738,1.5; 67 7.738,2; 68 7.738,2.5; 69 7.738,3; 70 7.738,3.5; 71 7.738,4; 72 7.738,4.5; 73 7.738,5; 74 7.738,5.5; 75 7.738,6 | smd 0.3 x 1.475: 26 -6,-7.738; 27 -5.5,-7.738; 28 -5,-7.738; 29 -4.5,-7.738; 30 -4,-7.738; 31 -3.5,-7.738; 32 -3,-7.738; 33 -2.5,-7.738; 34 -2,-7.738; 35 -1.5,-7.738; 36 -1,-7.738; 37 -0.5,-7.738; 38 0,-7.738; 39 0.5,-7.738; 40 1,-7.738; 41 1.5,-7.738; 42 2,-7.738; 43 2.5,-7.738; 44 3,-7.738; 45 3.5,-7.738; 46 4,-7.738; 47 4.5,-7.738; 48 5,-7.738; 49 5.5,-7.738; 50 6,-7.738; 76 6,7.738; 77 5.5,7.738; 78 5,7.738; 79 4.5,7.738; 80 4,7.738; 81 3.5,7.738; 82 3,7.738; 83 2.5,7.738; 84 2,7.738; 85 1.5,7.738; 86 1,7.738; 87 0.5,7.738; 88 0,7.738; 89 -0.5,7.738; 90 -1,7.738; 91 -1.5,7.738; 92 -2,7.738; 93 -2.5,7.738; 94 -3,7.738; 95 -3.5,7.738; 96 -4,7.738; 97 -4.5,7.738; 98 -5,7.738; 99 -5.5,7.738; 100 -6,7.738
INDC3225X270N = smd 1.3 x 2.7: 1 -1.4,0; 2 1.4,0
CMT8530SSMTTR = smd 2.5 x 2.5: 1 -3.5,-3.5; 2 3.5,-3.5; 3 3.5,3.5; 4 -3.5,3.5 | hole 2.54: 0,0
SOT23 = smd 1 x 1.4: 1 -0.95,-1.1; 2 0.95,-1.1; 3 0,1.1
SOT90P248X115-3N = smd 1.1 x 0.6: 1 -1.1,0.9; 2 -1.1,-0.9; 3 1.1,0
R0603 = smd 1 x 1.1: 1 -0.85,0; 2 0.85,0
PEC11R4220FS0024 = drill 1.1 pad 1.65: 1 0,0; 2 5,0; A1 0,-14.5; B1 5,-14.5; C1 2.5,-14.5 | drill 3.441 pad 5.161: MH1 -3.2,-7; MH2 8.2,-7
1X03/90 = drill 1.016 long: 1 -2.54,-3.81; 2 0,-3.81; 3 2.54,-3.81
TC2030IDC = smd 0.783 x 0.783: 1 -0.953,-0.635; 2 -0.953,0.635; 3 0.317,-0.635; 4 0.317,0.635; 5 1.588,-0.635; 6 1.588,0.635 | hole 2.451: -2.223,-2.54; -2.223,2.54; 0.952,-2.54; 0.952,2.54 | hole 1.067: -2.223,0; 2.857,-1.016; 2.857,1.016
SOIC127P790X216-8N = smd 2.108 x 0.6: 1 -3.346,1.905; 2 -3.346,0.635; 3 -3.346,-0.635; 4 -3.346,-1.905; 5 3.346,-1.905; 6 3.346,-0.635; 7 3.346,0.635; 8 3.346,1.905
1X04 = drill 1.016 long: 1 -3.81,0; 2 -1.27,0; 3 1.27,0; 4 3.81,0
GCT_USB4085-GF-A_REVA4 = drill 0.4 pad 0.65: A1 -2.975,4.025; A4 -2.125,4.025; A5 -1.275,4.025; A6 -0.425,4.025; A7 0.425,4.025; A8 1.275,4.025; A9 2.125,4.025; A12 2.975,4.025; B1 2.975,2.675; B4 2.125,2.675; B5 1.275,2.675; B6 0.425,2.675; B7 -0.425,2.675; B8 -1.275,2.675; B9 -2.125,2.675; B12 -2.975,2.675 | drill 0.6 pad 1.108 long: P1 -4.325,3.045; P2 4.325,3.045; P3 4.325,-0.335; P4 -4.325,-0.335

### Placement (x,y rotation side)
24V  5.08,14.1 90 top
BLDC  49.53,49.53 0 top
BOOT0  64.77,6.35 90 top
BOOT1  72.39,6.35 90 top
C1  35.56,13.97 135 top
C2  64.77,17.78 180 top
C3  42.16,12.95 135 top
C4  49.53,27.94 315 top
C5  80.01,15.24 180 top
C6  63.5,38.1 270 top
C7  43.18,36.83 315 top
C8  10.16,29.21 180 top
C9  80.01,17.78 0 top
C10  10.16,24.13 270 top
C11  49.4,20.19 135 top
C12  17.78,19.05 270 top
C13  19.05,19.05 270 top
C14  16.51,11.43 270 top
C15  13.08,14.61 270 top
C16  21.59,15.24 270 top
C17  10.79,14.61 270 top
C24  26.67,30.48 225 top
C25  2.54,24.13 270 top
C33  41.91,35.56 315 top
C34  27.69,29.46 225 top
C35  54.36,21.84 270 top
C36  55.88,21.84 270 top
C38  48.26,19.05 315 top
C39  43.31,14.1 135 top
CLOCK  45.72,16.51 45 top
CURRENT  40.64,49.53 0 top
D2  5.08,29.21 0 top
DISPLAY  97.79,24.13 0 top
EXT1  32.46,49.58 0 top
EXT2  67.31,49.53 0 top
EXT3  73.66,49.53 0 top
FAULT  54.61,8.89 90 top
FB  58.67,21.84 180 top
IC1  17.78,15.24 0 top
IC2  6.35,24.13 0 top
IC7  38.1,25.4 135 top
L1  21.59,19.3 90 top
LEVEL  86.36,49.53 0 top
LS1  92.71,25.4 270 top
PWR  54.61,3.81 90 top
Q1  72.9,40.13 270 top
Q2  96.52,17.78 270 top
Q3  80.14,40.51 180 top
Q4  72.9,36.96 270 top
Q5  80.14,37.08 180 top
R1  80.01,12.7 180 top
R2  57.4,33.91 180 top
R3  72.39,12.7 180 top
R4  64.77,12.7 180 top
R5  58.42,8.89 180 top
R6  58.42,6.35 180 top
R7  85.6,44.58 0 top
R8  52.2,44.45 0 top
R9  79.5,44.45 0 top
R10  89.53,41.91 180 top
R11  85.6,41.91 180 top
R12  76.71,40.39 270 top
R13  66.55,40.26 270 top
R14  8.89,38.23 0 top
R15  8.89,36.32 0 top
R16  58.42,3.81 180 top
R17  81.28,33.02 270 top
R18  72.39,15.24 180 top
R19  68.58,15.24 0 top
R20  64.77,15.24 180 top
R21  76.2,15.24 0 top
R22  90.17,17.78 270 top
R23  8.89,40.64 180 top
R24  8.89,33.91 180 top
R25  69.09,40.26 270 top
R26  76.71,36.96 270 top
R27  66.55,36.96 270 top
R28  69.09,36.96 270 top
R31  58.42,11.43 180 top
R40  92.71,17.78 90 top
RST  80.01,6.35 90 top
S4  69.85,33.02 0 top
SERVO  105.41,25.4 270 top
STAT  54.61,11.43 90 top
STEAM  80.01,49.53 0 top
SW/LED  58.42,49.53 0 top
SWD  27.43,6.6 90 top
TEMPERATURE  102.87,49.53 0 top
U5  57.15,38.1 180 top
UART  27.28,42.42 180 top
USB  2.08,37.36 270 top
WTR_LOW  54.61,6.35 90 top

### Tracks (layer width: path | path; a pad name or v marks a point on that pad's centre or on a via)
+3V3  (via drill 0.35)
  Top 0.152: IC7.100 36.87,14.04 C1.1 36.18,12.05 v35.56,11.43 35.56,4.57 33.15,2.16 28.96,2.16 28.32,2.79 28.32,5.4 SWD.1 | IC7.19 46.46,21.29 47.11,21.29 48.82,19.57 C11.1 51.18,18.41 | IC7.28 48.33,28.56 C4.1 52.1,31.75 v53.85,31.75 v57.15,31.75 | IC7.50 40.13,35.92 40.13,37.59 40.64,38.1 | 40.64,38.1 41.91,38.1 C7.1 | C7.1 | IC7.75 27.41,27.61 27.24,27.61 25.07,29.78 25.07,30.15 26.02,31.1 C24.1 26.78,31.61 26.78,35.16 v29.97,38.35 | R19.2 R18.2 71.5,15.28 v71.5,16.51 | IC7.11 41.98,20.11 41.7,20.11 40.21,18.62 40.21,18.34 IC7.6 41.91,16.64 41.91,15 41.71,14.8 41.71,14.5 42.78,13.42 C3.1 44.7,10.41 v45.21,10.41 | R11.2 84.75,43.05 | 84.75,43.05 R7.1 | BOOT0.4 BOOT0.3 64.78,2.15 v64.77,2.16 | R1.2 76.78,12.7 BOOT1.4 BOOT1.3 72.53,2.15 v72.52,2.16 | R16.1 v60.96,3.81 | 51.18,18.41 51.82,17.78 v59.69,17.78 59.75,17.84 FB.1 59.75,26.67 57.21,29.21 v57.15,29.21 | 40.64,38.1 42.93,40.39 v42.93,46.35 | R2.2 54.23,33.91 v53.85,34.29 53.8,34.33 U5.8 U5.7 55.5,37.47 56.77,38.73 U5.3 63.26,38.73 C6.1 63.89,38.98 64.77,38.1 64.77,35.56 v63.5,34.29 63.5,32.51 64.67,31.35 80.88,31.35 81.28,31.75 R17.2 83.82,32.17 85.09,33.44 85.09,39.37 86.25,40.53 | DISPLAY.2 96.52,39.37 95.36,40.53 89.3,40.53 | R11.2 84.75,41.02 85.24,40.53 86.25,40.53 | 86.25,40.53 89.3,40.53 | 89.3,40.53 88.69,41.15 R10.2 | LS1.2 89.21,25.33 v89.28,25.4 | TEMPERATURE.10 91.62,44.63 90.79,43.8 87.76,43.8 87.31,43.35 85.05,43.35 84.75,43.05 | 51.18,18.41 51.18,16.38 v50.55,15.75 | C7.1 45.1,37.45 v45.72,36.83 | v50.42,47.62 50.42,45.38 R8.1 | R9.1 78.65,43.76 78.87,43.54 82.06,43.54 83.69,41.91 R11.2 | UART.1 31.09,48.21 EXT1.1
  Top 0.305: v17.78,45.72 17.78,30.1 12.69,25 C10.1 10.08,25.08 IC2.5
  Bottom 0.152: v60.96,3.81 62.61,2.16 v64.77,2.16 v72.52,2.16 85.98,2.16 89.28,5.46 89.28,18.16 | v59.69,17.78 60.96,16.51 v71.5,16.51 87.63,16.51 89.28,18.16 | v89.28,25.4 89.28,18.16 | v35.56,11.43 36.58,10.41 v45.21,10.41 v50.55,15.75 | v63.5,34.29 v53.85,34.29 v53.85,31.75 50.8,31.75 v45.72,36.83 | v29.97,38.35 31.09,39.47 UART.1 32.74,42.42 37.95,47.62 41.66,47.62 | v42.93,46.35 41.66,47.62 | v57.15,29.21 v57.15,31.75 | v50.42,47.62 41.66,47.62
  Bottom 0.305: v17.78,45.72 30.1,45.72 31.09,44.73 UART.1
+5V  (via drill 0.35)
  Top 0.254: 21.58,20.43 L1.2
  Top 0.305: IC1.6 17.53,12.95 17.78,12.7 19.05,12.7 19.23,12.88 19.23,12.95 | 19.23,12.95 18.98,12.7 22.06,12.7 22.31,12.95 | 19.23,12.95 IC1.9 | C12.1 C13.1 19.68,19.93 20.19,20.43 21.58,20.43 | 22.31,12.95 22.35,12.95 17.4,8 2.16,8 1.27,8.89 1.27,23.73 C25.1 | 30.48,53.34 21.67,53.34 19.68,51.36 19.68,25.53 21.59,23.62 L1.2 22.98,20.7 23.62,20.07 23.62,14.27 22.31,12.95 | 30.48,53.34 v39.37,53.34 39.5,53.34 40.64,52.2 CURRENT.1 | D2.C 2.54,28.72 C25.1 | C25.1 2.61,25.08 IC2.1 6.04,25.08 6.22,24.89 6.22,23.37 6.04,23.18 IC2.3 | EXT1.2 31.21,52.61 30.48,53.34
  Bottom 0.152: 68.58,53.34 67.31,52.07 EXT2.1
  Bottom 0.305: SERVO.1 101.6,31.75 105.41,35.56 105.41,51.56 103.63,53.34 68.58,53.34 v39.37,53.34
+24V  (via drill 0.35)
  Top 0.152: R26.1 77.42,37.81 78.15,37.08 Q5.3 | R12.1 78.82,41.24 79.04,41.02 Q3.3 80.05,40.51 80.3,40.27 82.01,40.27 82.14,40.13 82.14,38.84 82.01,38.7 79.51,38.7 79.04,38.23 Q5.3 | v19.74,52.7 18.85,51.82 18.85,23.16 12.37,16.69 | Q5.3 82.01,37.07 82.93,38 82.93,41.27 81.42,42.78 74.69,42.78 71.12,46.35 62.86,46.35 60.96,48.26 v60.96,50.8
  Top 0.305: IC1.15 IC1.16 15.06,16.69 | 15.06,16.69 12.37,16.69 9.58,16.69 | 9.58,16.69 5.13,16.69 24V.2 | IC1.1 15.76,15.99 15.06,16.69 | C17.1 9.58,16.69
  Bottom 0.152: v60.96,50.8 60.96,50.89 59.12,52.73 19.76,52.73 v19.74,52.7
BLDC_DIR
  Top 0.152: IC7.66 29.01,32.37 29.01,34.26 42.29,47.54 42.29,49.91 43.43,51.05 48.77,51.05 49.53,50.29 BLDC.1
BLDC_EN  (via drill 0.35)
  Top 0.152: IC7.67 28.7,31.97 28.7,34.51 41.91,47.71 v41.91,50.8
  Bottom 0.152: v41.91,50.8 45.76,50.8 BLDC.3
BLDC_V
  Top 0.152: IC7.65 29.31,32.77 29.31,34 43.59,48.28 47.67,48.28 48.28,48.9 BLDC.2
BOOT0  (via drill 0.35)
  Top 0.152: R4.2 62.52,11.3 BOOT0.2 62.52,7.33 | BOOT0.1 62.52,7.33 | IC7.94 33.66,16.71 33.66,12.06 v34.29,11.43 | v63.5,6.35 62.52,7.33
  Bottom 0.152: v63.5,6.35 63.5,6.11 62.83,5.44 36.6,5.44 34.29,7.75 v34.29,11.43
BOOT1
  Top 0.152: R3.2 70.14,11.3 BOOT1.2 BOOT1.1
BUZZ  (via drill 0.35)
  Top 0.152: R40.1 R22.2 88.05,16.93 85.09,19.89 85.09,27.94 82.93,30.1 56.77,30.1 55.88,29.21 v55.88,27.94 | IC7.26 48.61,25.83 49.96,25.83 v52.07,27.94
  Bottom 0.152: v52.07,27.94 v55.88,27.94
CS1  (via drill 0.35)
  Top 0.152: v29.84,33.78 31.84,33.78 IC7.60
  Bottom 0.152: TEMPERATURE.2 101.62,46.05 97.16,41.58 42.47,41.58 34.67,33.78 v29.84,33.78
CS2  (via drill 0.35)
  Top 0.152: v30.48,34.42 31.91,34.42 IC7.59
  Bottom 0.152: TEMPERATURE.3 100.37,45.76 96.77,42.16 42.44,42.16 34.57,34.29 30.6,34.29 v30.48,34.42
CS3  (via drill 0.35)
  Top 0.152: v31.12,35.05 31.98,35.05 IC7.58
  Bottom 0.152: TEMPERATURE.5 97.79,49.45 97.79,44.45 96.27,42.93 42.52,42.93 34.57,34.98 31.19,34.98 v31.12,35.05
CS4  (via drill 0.35)
  Top 0.152: v31.75,35.69 32.06,35.69 IC7.57
  Bottom 0.152: TEMPERATURE.6 96.52,49.43 96.52,44.45 95.5,43.43 42.34,43.43 34.59,35.69 v31.75,35.69
CS5  (via drill 0.35)
  Top 0.152: IC7.61 31.89,33.02 v30.48,33.02
  Bottom 0.152: v30.48,33.02 30.53,32.97 34.54,32.97 42.47,40.89 97.41,40.89 102.81,46.3 102.81,49.47 TEMPERATURE.1
ENC_A  (via drill 0.35)
  Top 0.152: IC7.42 40.35,30.48 v39.37,30.48 | R20.2 v59.69,15.24
  Bottom 0.152: v39.37,30.48 54.61,15.24 v59.69,15.24
ENC_B  (via drill 0.35)
  Top 0.152: IC7.40 41.91,30.62 v41.91,27.18 | R21.2 77.05,14.35 76.67,13.97 v59.69,13.97
  Bottom 0.152: v59.69,13.97 55.12,13.97 v41.91,27.18
ENC_SW  (via drill 0.35)
  Top 0.152: IC7.41 40.64,30.06 v40.64,29.97 | R17.1 79.63,33.87 77.46,31.7 71.17,31.7 S4.1
  Bottom 0.152: v40.64,29.97 54.1,29.97 57.15,33.02 S4.1
GND  (via drill 0.35)
  Top 0.152: C1.2 35.5,15.15 35.63,15.15 IC7.99 | IC7.20 46.75,21.7 47.89,21.7 C11.2 | IC7.27 47.5,26.98 48.26,27.74 48.58,27.74 49,27.32 C4.2 | C24.2 C34.2 28.24,27.68 28.24,27.66 28.74,27.15 IC7.74 | FAULT.C WTR_LOW.C PWR.C | SWD.5 28.38,8.19 30.1,9.91
  Top 0.254: 16.33,14.82 16.49,14.99 17.53,14.99 IC1.17 | 10.99,13.73 C17.2 10.79,13.34 | 19.05,16.96 C13.2 C12.2
  Top 0.305: IC1.17 17.78,15.72 18.03,15.97 IC1.14 IC1.13 18.78,16.69 19.05,16.96 | IC1.3 IC1.4 14.85,14.48 14.1,13.73 C15.2
  Bottom 0.152: v43.43,17.14 40.39,14.1 v40.39,12.57
  other vias: 27.43,16.76 45.97,19.68
  pour Top: -1.27,-2.54 -1.27,57.15 114.3,57.15 115.57,55.88 115.57,-2.54
  pour Bottom: -1.27,60.96 -1.27,-1.27 0,-2.54 111.76,-2.54 118.11,3.81 118.11,54.61 111.76,60.96
GPIO1
  Top 0.152: IC7.77 27.78,22.86 25.65,22.86 21.84,26.67 21.84,44.61 23.57,46.33 27.66,46.33 28.71,47.38 EXT1.4
GPIO2
  Top 0.152: IC7.78 28.03,22.4 25.58,22.4 21.41,26.57 21.41,44.65 23.62,46.86 26.54,46.86 27.46,47.78 EXT1.5
GPIO3
  Top 0.152: IC7.79 28.33,22 25.45,22 21.03,26.42 21.03,44.78 23.68,47.43 25.34,47.43 26.21,48.31 EXT1.6
GPIO4
  Top 0.152: IC7.80 28.61,21.57 25.43,21.57 20.57,26.42 20.57,44.94 23.5,47.87 24.38,47.87 24.96,48.46 EXT1.7
HEATER  (via drill 0.35)
  Top 0.152: IC7.63 v39.24,24.26 | v39.24,24.26 | v44.7,46.35 44.7,38.73 v44.45,38.48
  Bottom 0.152: v39.24,24.26 36.25,27.25 36.25,31.46 42,37.21 43.18,37.21 v44.45,38.48 | EXT3.1 73.66,48.26 71.75,46.35 v44.7,46.35
HEATER2  (via drill 0.35)
  Top 0.152: IC7.64 38.1,24.69 v38.1,24.13 | v43.81,46.99 43.81,38.99 v43.31,38.48
  Bottom 0.152: v38.1,24.13 35.56,26.67 35.56,31.75 42.29,38.48 v43.31,38.48 | EXT2.3 64.81,48.3 63.5,46.99 v43.81,46.99
I  (via drill 0.35)
  Top 0.152: IC7.16 42.1,23.52 40.04,23.52 38.62,22.1 36.32,22.1 v33.02,25.4 | v24.77,33.66 24.77,35.16 29.09,39.49 32.25,39.49 39.37,46.61 39.37,49.51 CURRENT.2
  Bottom 0.152: v33.02,25.4 v24.77,33.66
I2C1_SCL  (via drill 0.35)
  Top 0.152: R10.1 96.52,41.91 99.06,39.37 DISPLAY.3 | IC7.92 31.4,15.88 30.99,15.88 v30.61,15.49
  Bottom 0.152: v30.61,15.49 34.29,19.18 34.29,31.88 42.67,40.26 103.25,40.26 104.14,39.37 104.14,36.45 103.12,35.43 100.46,35.43 DISPLAY.3
I2C1_SDA  (via drill 0.35)
  Top 0.152: DISPLAY.4 101.6,39.37 97.79,43.18 88.14,43.18 86.87,41.91 R11.1 | IC7.93 31.75,15.51 31.75,14.99 v31.37,14.61
  Bottom 0.152: v31.37,14.61 34.8,18.03 34.8,31.75 42.42,39.37 100.84,39.37 101.6,38.61 DISPLAY.4
LED1  (via drill 0.35)
  Top 0.152: R6.1 v60.96,6.35 | IC7.44 39.7,31.24 v38.48,31.24
  Bottom 0.152: v38.48,31.24 37.95,31.77 37.5,31.77 36.81,31.08 36.81,30.5 v60.96,6.35
LED2  (via drill 0.35)
  Top 0.152: R5.1 v60.96,8.89 | v37.34,30.86 38.43,31.95 39.7,31.95 IC7.45
  Bottom 0.152: v37.34,30.86 37.57,30.63 37.57,30.58 59.31,8.84 60.91,8.84 v60.96,8.89
LED_SW1
  Top 0.152: IC7.37 47.42,34.02 47.42,37.55 52.17,42.29 68.54,42.29 69.09,41.74 R25.1
LED_SW2
  Top 0.152: IC7.36 47.83,33.71 47.83,37.52 52.22,41.91 63.75,41.91 64.77,40.89 64.77,39.37 65.6,38.54 67.45,38.54 68.17,37.81 R28.1
LVL
  Top 0.152: R7.2 86.45,49.44 | 86.45,49.44 LEVEL.1 | IC7.39 46.69,34.69 46.69,45.59 53.16,52.07 85.09,52.07 86.45,50.71 86.45,49.44
N$1
  Top 0.152: R14.1 7.59,37.78 7.58,37.79 USB.A6 5.86,37.79 5.01,36.94 USB.B6
N$2
  Top 0.152: R15.1 7.4,36.96 6.13,36.96 USB.A7
  Bottom 0.152: USB.B7 5.13,37.79 5.98,36.94 USB.A7
N$3  (via drill 0.35)
  Top 0.152: R24.2 8.13,33.82 v8.13,32.64
  Bottom 0.152: v8.13,32.64 8.13,33.4 7.72,33.81 5.83,33.81 5.52,34.12 5.52,35.7 5.12,36.09 USB.B5
N$4
  Top 0.152: R23.2 8.04,40.35 6.47,38.78 6.25,38.78 USB.A5
N$5
  Top 0.152: Q2.3 97.62,20.49 LS1.3
N$6
  Top 0.152: R6.2 WTR_LOW.A
N$7
  Top 0.152: PWR.A R16.2
N$9
  Top 0.152: FAULT.A R5.2
N$10
  Top 0.152: R31.2 STAT.A
N$12
  Top 0.152: R18.1 R21.1 75.35,18.02 S4.B1 76.88,18.52 77.62,17.78 C9.1
N$13
  Top 0.254: C14.1 16.51,13.27 IC1.5
N$14
  Top 0.152: S4.A1 68.58,18.52 67.73,17.67 R19.1 R20.1 65.64,15.27 C2.1
N$15
  Top 0.254: IC1.10 20.96,14.99 C16.2
N$16
  Top 0.152: C8.2 D2.A 5.86,29.21 3.56,31.51 | USB.B4 4.25,35.24 4.23,35.21 4.73,35.21 USB.B4 | USB.B4 4.83,35.24 USB.A9
  Top 0.305: 3.56,31.51 3.56,34.54 | 3.56,34.54 4.23,35.21 | 3.56,34.54 3.56,38.95 4.1,39.49 USB.B9 USB.A4 | 4.25,35.24 4.83,35.24 | USB.B4 USB.A9
N$17
  Top 0.152: Q1.3 75.01,40.13 75.61,39.54 R12.2 81.16,39.54 Q3.1
N$19
  Top 0.305: C15.1 IC1.2
N$21
  Top 0.254: 21.46,15.99 C16.1
  Top 0.305: 21.46,15.99 IC1.12 IC1.11 | C16.1 L1.1
N$22
  Top 0.152: R13.2 R25.2 69.72,39.41 71.4,41.08 Q1.1
N$23
  Top 0.152: C34.1 28.3,28.12 IC7.73
N$24
  Top 0.152: Q4.3 75.01,36.96 75.86,36.11 R26.2 80.14,36.11 80.22,36.18 Q5.1
N$26
  Top 0.152: R27.2 R28.2 69.72,36.11 71.52,37.91 Q4.1
N$27
  Top 0.152: FB.2 56.72,22.72 C36.1 C35.1 52.17,22.72 51.68,22.23 47.64,22.23 IC7.22 IC7.21
N$28
  Top 0.152: Q3.2 81.24,41.79 80.66,42.37 74.17,42.37 70.94,45.59 58.55,45.59 57.17,46.97 SW/LED.2
N$29
  Top 0.152: SW/LED.3 55.92,47.71 58.37,45.26 70.84,45.26 74.04,42.06 79.3,42.06 80.66,40.7 82.14,40.7 82.45,40.39 82.45,38.46 81.97,37.98 Q5.2
N$35
  Top 0.152: Q2.1 92.81,18.73 R40.2
N$38
  Top 0.152: IC7.49 41.1,36.18 C33.1
N$47
  Top 0.152: IC7.13 45.22,18.28 45.5,18.28 CLOCK.3 45.93,17.96 C38.1
N$52
  Top 0.152: IC7.12 44.28,18.52 44.28,17.84 46.03,16.08 46.03,15.69 CLOCK.1 45.51,15.06 C39.1
P  (via drill 0.35)
  Top 0.152: IC7.15 44.23,20.64 42.24,22.63 40.79,22.63 v40.77,22.61 | v65.28,32.26 65.28,33.53 66.67,34.92 82.17,34.92 83.49,36.25 83.49,41.66 81.93,43.21 75.21,43.21 71.01,47.41 66.78,47.41 66.06,48.13 EXT2.2 | v39.88,26.29 39.9,26.27 44.94,26.27 v44.96,26.29
  Bottom 0.152: v65.28,32.26 59.31,26.29 v44.96,26.29 | v40.77,22.61 40.79,22.63 40.79,25.38 v39.88,26.29
RST  (via drill 0.35)
  Top 0.152: C5.1 80.89,12.72 R1.1 82.26,11.3 RST.4 RST.3 80.01,4.39 v80.01,6.35 | SWD.3 29.02,5.97 32.38,5.97 v33.4,6.99 | IC7.14 42.62,21.59 v41.91,21.59
  Bottom 0.152: v41.91,21.59 33.4,13.08 v33.4,6.99 33.4,6.86 35.31,4.95 78.61,4.95 v80.01,6.35
SCLK  (via drill 0.35)
  Top 0.152: IC7.52 34.92,36.35 v34.92,38.86
  Bottom 0.152: v34.92,38.86 36.2,38.86 42.16,44.83 93.36,44.83 94.12,45.59 TEMPERATURE.8
SDI  (via drill 0.35)
  Top 0.152: IC7.54 33.66,36.21 v33.66,37.59
  Bottom 0.152: v33.66,37.59 33.75,37.49 35.72,37.49 42.29,44.07 94.73,44.07 95.37,44.7 TEMPERATURE.7
SDO  (via drill 0.35)
  Top 0.152: IC7.53 34.29,36.28 v34.29,38.23
  Bottom 0.152: v34.29,38.23 34.29,38.99 34.92,39.62 36.07,39.62 41.97,45.53 92.3,45.53 92.87,46.1 TEMPERATURE.9
SERVO
  Top 0.152: IC7.62 38.81,25.4 50.92,25.4 56.38,30.86 98.3,30.86 99.06,30.1 99.06,26.16 99.82,25.4 SERVO.2
SPI1_CS
  Top 0.152: U5.1 60.5,36.15 R2.1 58.25,33.78 56.98,32.51 51.58,32.51 IC7.29
SPI1_MISO  (via drill 0.35)
  Top 0.152: IC7.31 49.66,32.01 v49.66,34.29 | U5.2 v57.15,37.47
  Bottom 0.152: v49.66,34.29 52.83,37.47 v57.15,37.47
SPI1_MOSI
  Top 0.152: U5.5 52.53,40.01 48.97,36.45 48.97,32.03 IC7.32
SPI1_SCK
  Top 0.152: IC7.30 50.29,31.93 50.29,36.65 52.38,38.73 U5.6
STAT
  Top 0.152: R31.1 59.27,12.48 58.67,13.08 49.91,13.08 45.72,8.89 41.91,8.89 39.37,11.43 39.37,15.64 IC7.1
STEAM
  Top 0.152: R9.2 80.35,49.19 STEAM.1 80.01,50.42 78.74,51.69 53.21,51.69 46.99,45.47 46.99,34.29 IC7.38
SW2  (via drill 0.35)
  Top 0.152: IC7.35 48.26,33.44 48.26,37.08 v49.91,38.73 | SW/LED.1 58.42,50.42 58.04,50.8 53.47,50.8 53.05,50.38 R8.2 53.05,44.16 v47.62,38.73
  Bottom 0.152: v47.62,38.73 v49.91,38.73
SWCLK  (via drill 0.35)
  Top 0.152: SWD.4 26.8,6.86 25.91,5.97 22.99,5.97 22.35,6.6 22.35,9.15 24.49,11.28 v24.49,20.88 | IC7.76 v27.38,25.17
  Bottom 0.152: v27.38,25.17 27.38,23.77 v24.49,20.88
SWDIO  (via drill 0.35)
  Top 0.152: SWD.2 26.54,5.4 26.54,2.79 25.84,2.1 22.29,2.1 21.59,2.79 v21.59,10.16 | IC7.72 v31.75,25.4
  Bottom 0.152: v21.59,10.16 21.59,22.86 25.4,26.67 30.48,26.67 v31.75,25.4
SWO
  Top 0.152: SWD.6 26.86,8.19 27.43,8.76 27.43,14.03 IC7.89
UART3_RX  (via drill 0.35)
  Top 0.152: IC7.56 32.38,36.06 v32.38,36.32
  Bottom 0.152: UART.3 26.01,38.23 27.91,36.32 v32.38,36.32
UART3_TX  (via drill 0.35)
  Top 0.152: v33.02,36.96 32.97,36.91 32.97,36.19 IC7.55
  Bottom 0.152: v33.02,36.96 33.02,36.98 29.47,36.98 28.55,37.9 UART.2
USB_DM  (via drill 0.35)
  Top 0.152: IC7.70 29.65,28.9 29.65,30.56 28.32,31.89 28.32,35.05 v27.94,35.43 | v15.11,36.32 R15.2
  Bottom 0.152: v27.94,35.43 16,35.43 v15.11,36.32
USB_DP  (via drill 0.35)
  Top 0.152: IC7.71 29.3,28.55 29.3,30.48 27.43,32.34 v27.43,34.29 | v13.97,38.23 R14.2
  Bottom 0.152: v27.43,34.29 15.12,34.29 13.97,35.45 v13.97,38.23

### Text on the board
tNames: GND PC12 PC11 PC10 PC9 VCC | G | RX | TX | 3V3 | kafi ctrl rev 4 / designed by linusleo
tStop: bijou. | /Users/linus/Downloads/Coffee-cup-icon-by-LeisureProjects-580x387.bmp